# Altium project PS Display.PrjPcb
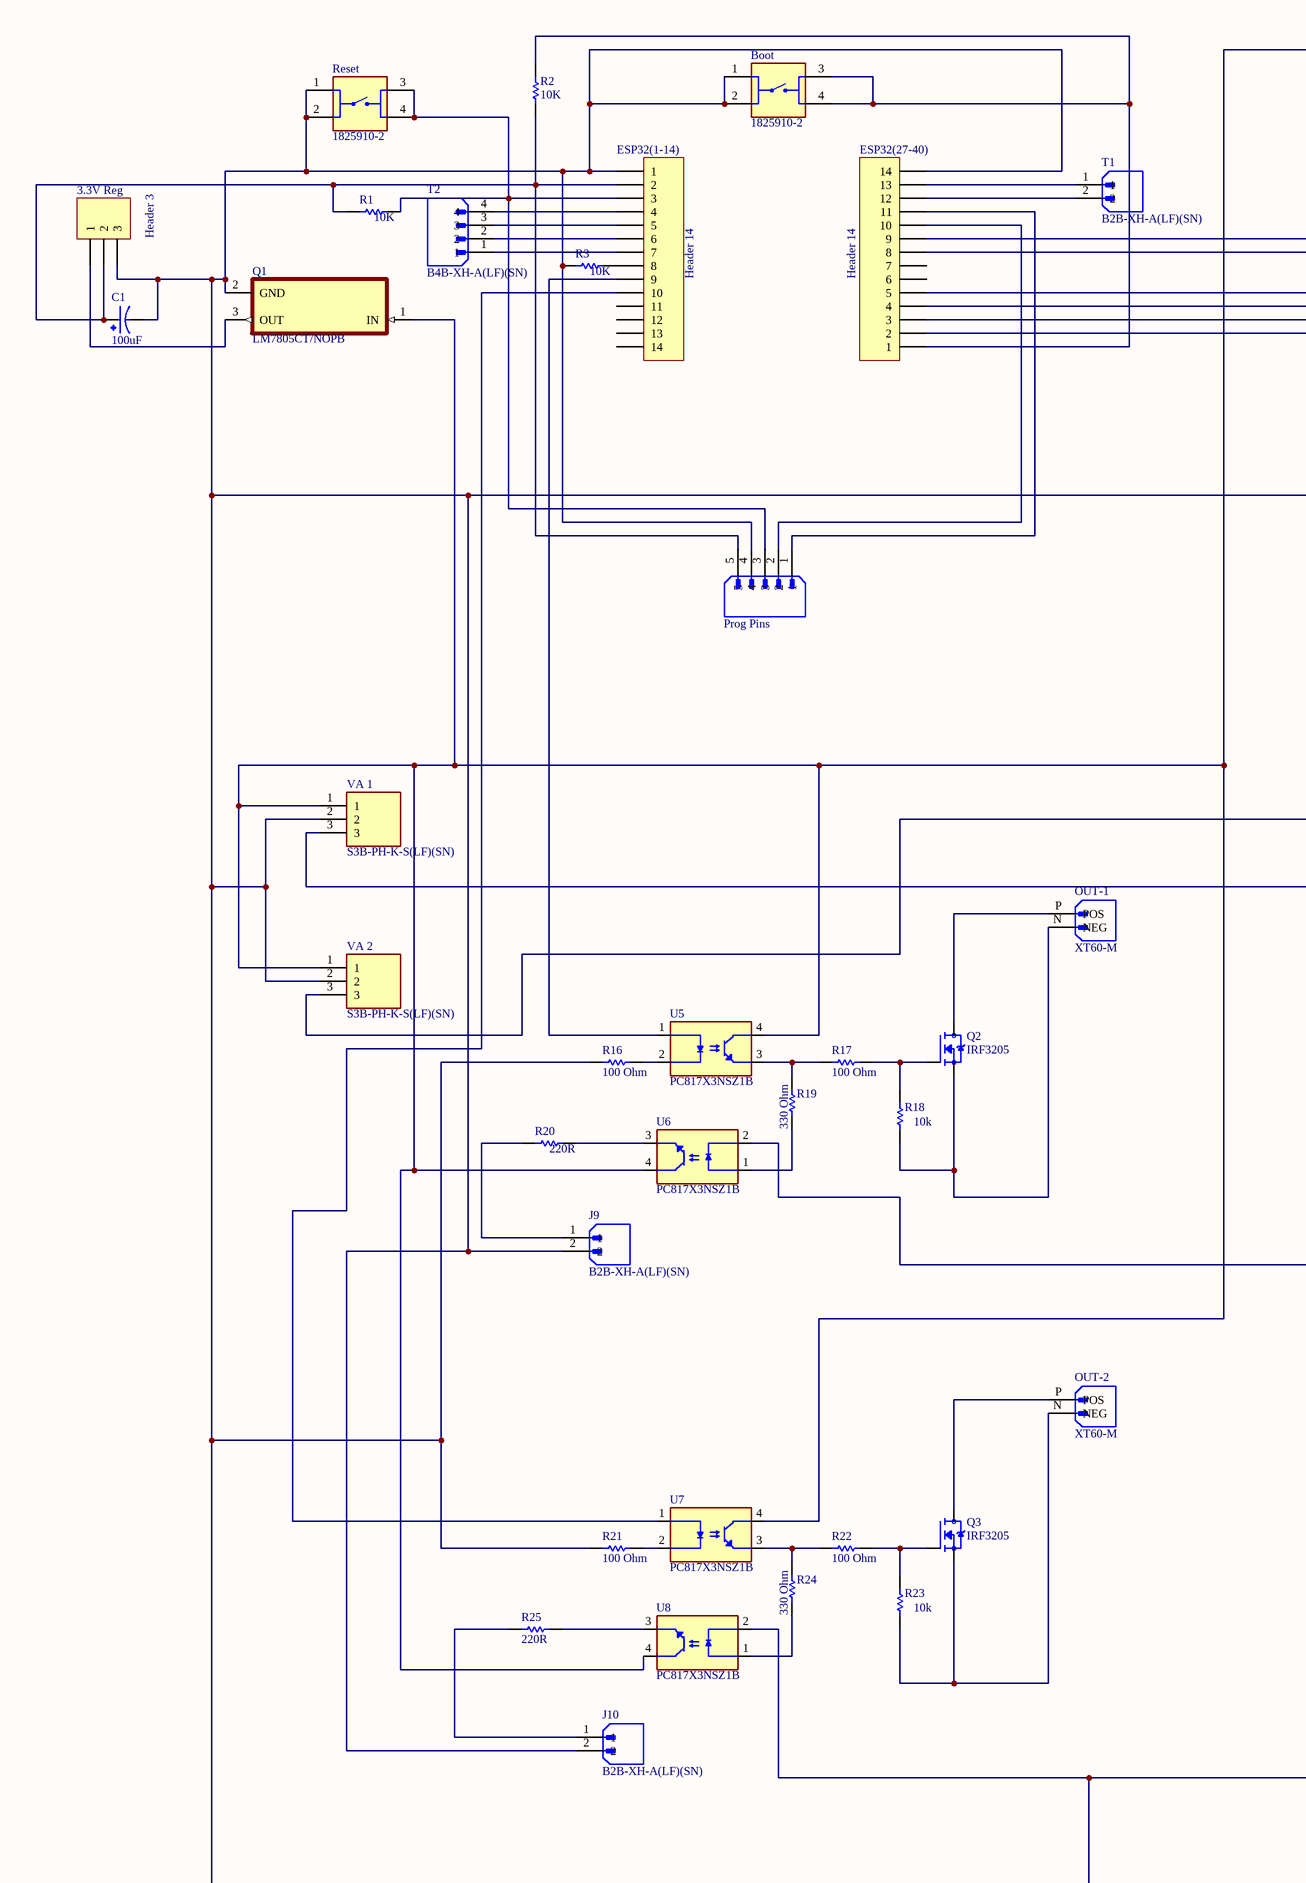
[diagram p0: Sheet1.SchDoc, left]
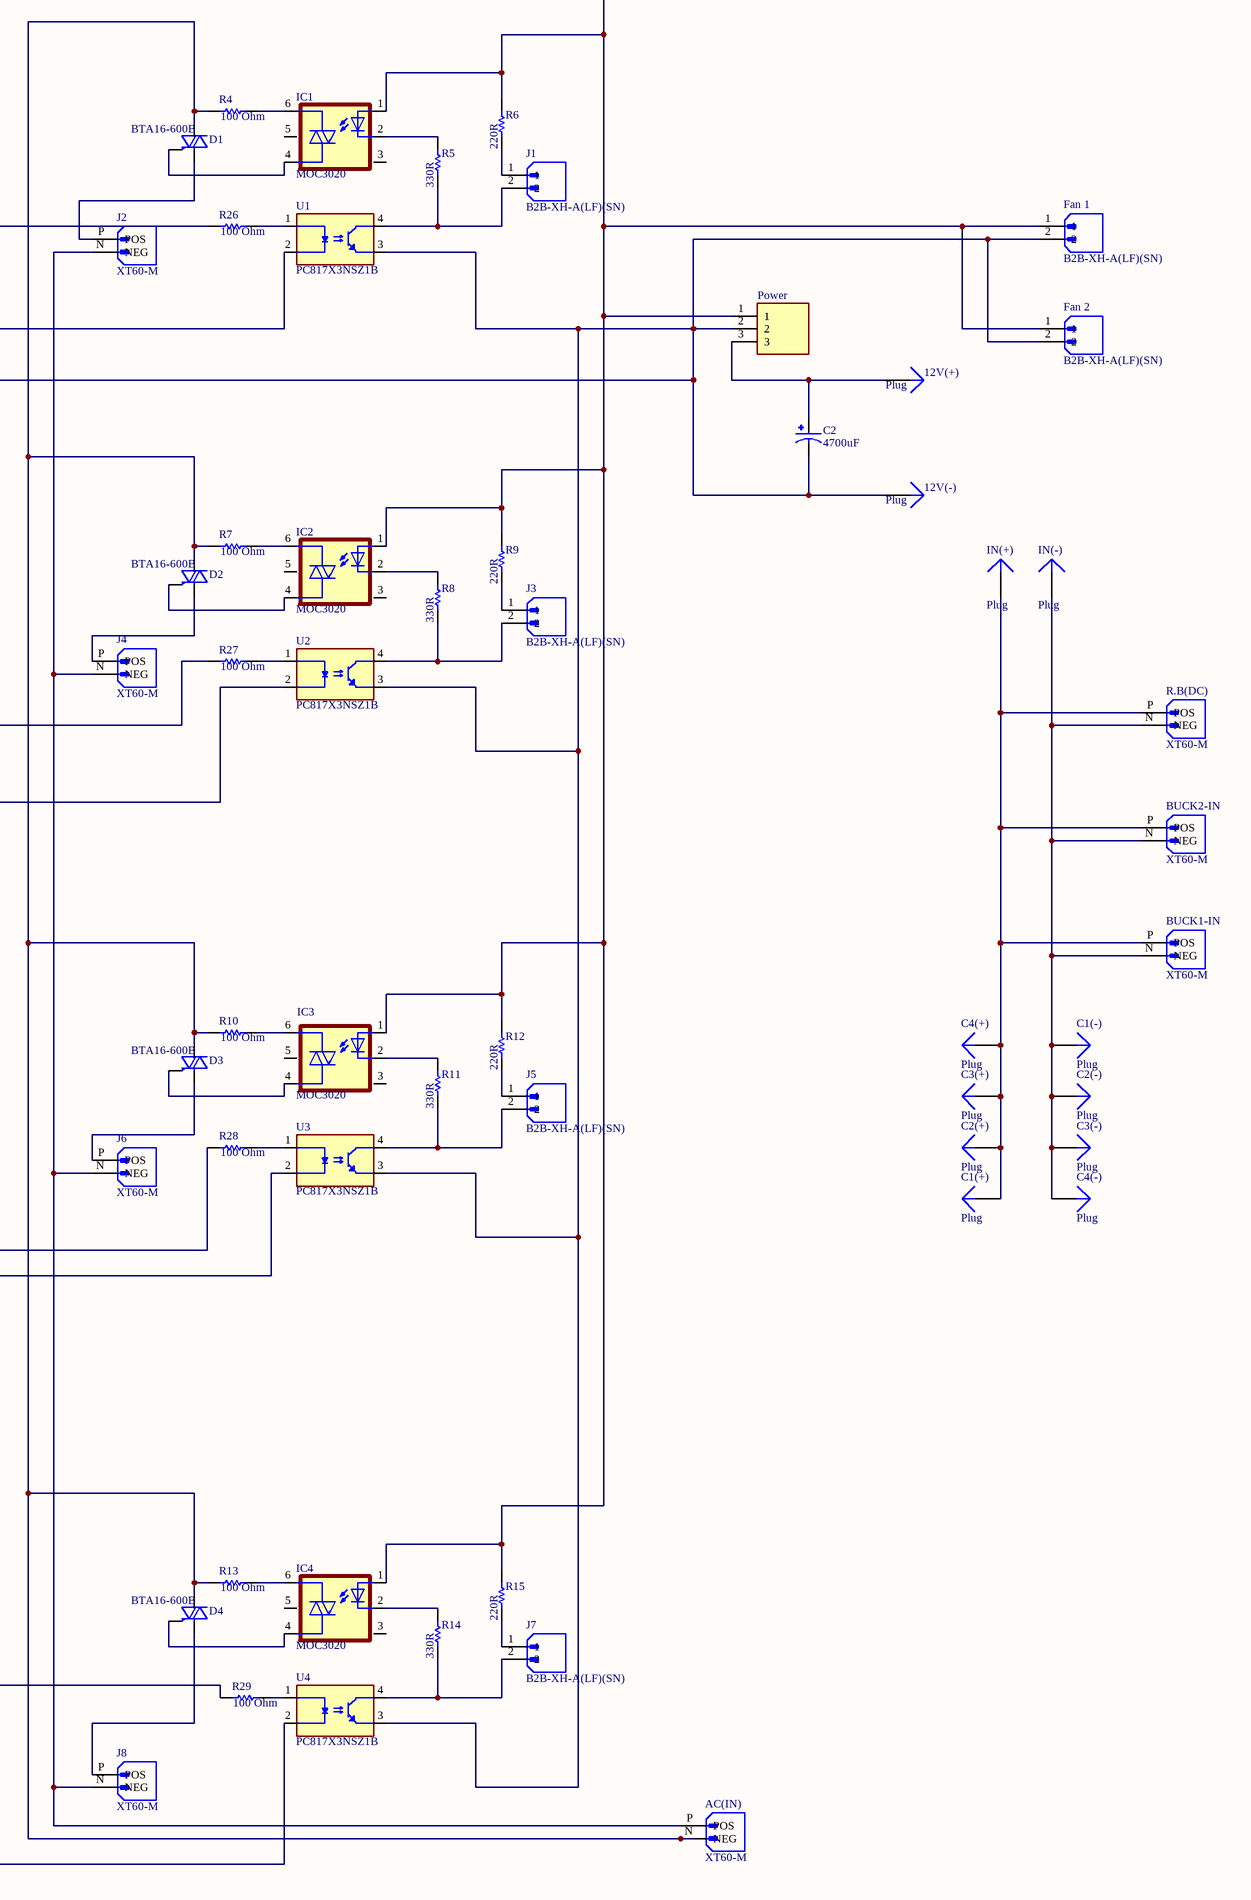
[diagram p1: Sheet1.SchDoc, right]
1 sheet, 91 parts. Net scope: global (net labels, ports and power ports of the same name join across sheets).
Board file: PCB1.PcbDoc

## Sheet Sheet1.SchDoc
size A2

### Parts
3.3V_Reg  Header 3  [HDR1X3]
12V(+)  Plug  [PIN1]
12V(-)  Plug  [PIN1]
AC(IN)  XT60-M  [AMASS_XT60-M]
Boot  1825910-2  [TE_1825910-2]
BUCK1-IN  XT60-M  [AMASS_XT60-M]
BUCK2-IN  XT60-M  [AMASS_XT60-M]
C1  100uF  [CAPPRD250W50D630H1500]
C1(+)  Plug  [PIN1]
C1(-)  Plug  [PIN1]
C2  4700uF  [CAPPRD750W80D1800H3150]
C2(+)  Plug  [PIN1]
C2(-)  Plug  [PIN1]
C3(+)  Plug  [PIN1]
C3(-)  Plug  [PIN1]
C4(+)  Plug  [PIN1]
C4(-)  Plug  [PIN1]
D1  BTA16-600B  [TO255P1040X460X1975-3]
D2  BTA16-600B  [TO255P1040X460X1975-3]
D3  BTA16-600B  [TO255P1040X460X1975-3]
D4  BTA16-600B  [TO255P1040X460X1975-3]
ESP32(1-14)  Header 14  [HDR1X14]
ESP32(27-40)  Header 14  [HDR1X14]
Fan_1  B2B-XH-A(LF)(SN)  [JST_B2B-XH-A(LF)(SN)]
Fan_2  B2B-XH-A(LF)(SN)  [JST_B2B-XH-A(LF)(SN)]
IC1  MOC3020  [DIL06-A]
IC2  MOC3020  [DIL06-A]
IC3  MOC3020  [DIL06-A]
IC4  MOC3020  [DIL06-A]
IN(+)  Plug  [PIN1]
IN(-)  Plug  [PIN1]
J1  B2B-XH-A(LF)(SN)  [JST_B2B-XH-A(LF)(SN)]
J2  XT60-M  [AMASS_XT60-M]
J3  B2B-XH-A(LF)(SN)  [JST_B2B-XH-A(LF)(SN)]
J4  XT60-M  [AMASS_XT60-M]
J5  B2B-XH-A(LF)(SN)  [JST_B2B-XH-A(LF)(SN)]
J6  XT60-M  [AMASS_XT60-M]
J7  B2B-XH-A(LF)(SN)  [JST_B2B-XH-A(LF)(SN)]
J8  XT60-M  [AMASS_XT60-M]
J9  B2B-XH-A(LF)(SN)  [JST_B2B-XH-A(LF)(SN)]
J10  B2B-XH-A(LF)(SN)  [JST_B2B-XH-A(LF)(SN)]
OUT-1  XT60-M  [AMASS_XT60-M]
OUT-2  XT60-M  [AMASS_XT60-M]
Power  (no value)  [JST_S3B-PH-K-S(LF)(SN)]
Prog_Pins  (no value)  [JST_B5B-XH-A(LF)(SN)]
Q1  LM7805CT/NOPB  [TO254P1054X470X1955-3]
Q2  IRF3205  [TO254P1041X444X2933-3]
Q3  IRF3205  [TO254P1041X444X2933-3]
R1  value 10K  [AXIAL-0.3]
R2  value 10K  [AXIAL-0.3]
R3  value 10K  [AXIAL-0.3]
R4  value 100 Ohm  [AXIAL-0.3]
R5  value 330R  [AXIAL-0.3]
R6  value 220R  [AXIAL-0.3]
R7  value 100 Ohm  [AXIAL-0.3]
R8  value 330R  [AXIAL-0.3]
R9  value 220R  [AXIAL-0.3]
R10  value 100 Ohm  [AXIAL-0.3]
R11  value 330R  [AXIAL-0.3]
R12  value 220R  [AXIAL-0.3]
R13  value 100 Ohm  [AXIAL-0.3]
R14  value 330R  [AXIAL-0.3]
R15  value 220R  [AXIAL-0.3]
R16  value 100 Ohm  [AXIAL-0.3]
R17  value 100 Ohm  [AXIAL-0.3]
R18  value 10k  [AXIAL-0.3]
R19  value 330 Ohm  [AXIAL-0.3]
R20  value 220R  [AXIAL-0.3]
R21  value 100 Ohm  [AXIAL-0.3]
R22  value 100 Ohm  [AXIAL-0.3]
R23  value 10k  [AXIAL-0.3]
R24  value 330 Ohm  [AXIAL-0.3]
R25  value 220R  [AXIAL-0.3]
R26  value 100 Ohm  [AXIAL-0.3]
R27  value 100 Ohm  [AXIAL-0.3]
R28  value 100 Ohm  [AXIAL-0.3]
R29  value 100 Ohm  [AXIAL-0.3]
R.B(DC)  XT60-M  [AMASS_XT60-M]
Reset  1825910-2  [TE_1825910-2]
T1  B2B-XH-A(LF)(SN)  [JST_B2B-XH-A(LF)(SN)]
T2  B4B-XH-A(LF)(SN)  [JST_B4B-XH-A(LF)(SN)]
U1  PC817X3NSZ1B  [DIP762W50P254L495H455Q4]
U2  PC817X3NSZ1B  [DIP762W50P254L495H455Q4]
U3  PC817X3NSZ1B  [DIP762W50P254L495H455Q4]
U4  PC817X3NSZ1B  [DIP762W50P254L495H455Q4]
U5  PC817X3NSZ1B  [DIP762W50P254L495H455Q4]
U6  PC817X3NSZ1B  [DIP762W50P254L495H455Q4]
U7  PC817X3NSZ1B  [DIP762W50P254L495H455Q4]
U8  PC817X3NSZ1B  [DIP762W50P254L495H455Q4]
VA_1  S3B-PH-K-S(LF)(SN)  [JST_S3B-PH-K-S(LF)(SN)]
VA_2  S3B-PH-K-S(LF)(SN)  [JST_S3B-PH-K-S(LF)(SN)]

### Nets
Net3.3V_Reg_1: 3.3V_Reg.1 Q1.3(OUT)
Net3.3V_Reg_2: 3.3V_Reg.2 C1.P ESP32(1-14).2 Prog_Pins.5 R1.1 R2.1
Net3.3V_Reg_3: 3.3V_Reg.3 12V(-).1 Boot.1 Boot.2 C1.N C2.N ESP32(1-14).1 ESP32(27-40).14 Fan_1.2 Fan_2.2 J9.2 J10.2 Power.2 Prog_Pins.4 Q1.2(GND) R3.1 R16.2 R21.2 Reset.1 Reset.2 U1.3(EMITTER) U2.3(EMITTER) U3.3(EMITTER) U4.3(EMITTER) U6.2(CATHODE) U8.2(CATHODE) VA_1.2 VA_2.2
Net12V(+)_1: 12V(+).1 C2.P Power.3
NetAC(IN)_N: AC(IN).N(NEG) D1.2(A2) D2.2(A2) D3.2(A2) D4.2(A2) R4.1 R7.1 R10.1 R13.1
NetAC(IN)_P: AC(IN).P(POS) J2.N(NEG) J4.N(NEG) J6.N(NEG) J8.N(NEG)
NetBoot_3: Boot.3 Boot.4 ESP32(27-40).1 R2.2
NetBUCK1-IN_N: BUCK1-IN.N(NEG) BUCK2-IN.N(NEG) C1(-).1 C2(-).1 C3(-).1 C4(-).1 IN(-).1 R.B(DC).N(NEG)
NetBUCK1-IN_P: BUCK1-IN.P(POS) BUCK2-IN.P(POS) C1(+).1 C2(+).1 C3(+).1 C4(+).1 IN(+).1 R.B(DC).P(POS)
NetD1_1: D1.1(A1) J2.P(POS)
NetD1_3: D1.3(G) IC1.4(A1)
NetD2_1: D2.1(A1) J4.P(POS)
NetD2_3: D2.3(G) IC2.4(A1)
NetD3_1: D3.1(A1) J6.P(POS)
NetD3_3: D3.3(G) IC3.4(A1)
NetD4_1: D4.1(A1) J8.P(POS)
NetD4_3: D4.3(G) IC4.4(A1)
NetESP32(1-14)_3: ESP32(1-14).3 Prog_Pins.3 R1.2 Reset.3 Reset.4
NetESP32(1-14)_4: ESP32(1-14).4 T2.4
NetESP32(1-14)_5: ESP32(1-14).5 T2.3
NetESP32(1-14)_6: ESP32(1-14).6 T2.2
NetESP32(1-14)_7: ESP32(1-14).7 T2.1
NetESP32(1-14)_8: ESP32(1-14).8 R3.2
NetESP32(1-14)_9: ESP32(1-14).9 U5.1(ANODE)
NetESP32(1-14)_10: ESP32(1-14).10 U7.1(ANODE)
NetESP32(27-40)_2: ESP32(27-40).2 R26.1
NetESP32(27-40)_3: ESP32(27-40).3 R27.1
NetESP32(27-40)_4: ESP32(27-40).4 R28.1
NetESP32(27-40)_5: ESP32(27-40).5 R29.1
NetESP32(27-40)_8: ESP32(27-40).8 VA_1.3
NetESP32(27-40)_9: ESP32(27-40).9 VA_2.3
NetESP32(27-40)_10: ESP32(27-40).10 Prog_Pins.2
NetESP32(27-40)_11: ESP32(27-40).11 Prog_Pins.1
NetESP32(27-40)_12: ESP32(27-40).12 T1.2
NetESP32(27-40)_13: ESP32(27-40).13 T1.1
NetFan_1_1: Fan_1.1 Fan_2.1 IC1.1(A) IC2.1(A) IC3.1(A) IC4.1(A) Power.1 Q1.1(IN) R6.2 R9.2 R12.2 R15.2 U5.4(COLLECTOR) U6.4(COLLECTOR) U7.4(COLLECTOR) U8.4(COLLECTOR) VA_1.1 VA_2.1
NetIC1_2: IC1.2(C) R5.2
NetIC1_6: IC1.6(A2) R4.2
NetIC2_2: IC2.2(C) R8.2
NetIC2_6: IC2.6(A2) R7.2
NetIC3_2: IC3.2(C) R11.2
NetIC3_6: IC3.6(A2) R10.2
NetIC4_2: IC4.2(C) R14.2
NetIC4_6: IC4.6(A2) R13.2
NetJ1_1: J1.1 R6.1
NetJ1_2: J1.2 R5.1 U1.4(COLLECTOR)
NetJ3_1: J3.1 R9.1
NetJ3_2: J3.2 R8.1 U2.4(COLLECTOR)
NetJ5_1: J5.1 R12.1
NetJ5_2: J5.2 R11.1 U3.4(COLLECTOR)
NetJ7_1: J7.1 R15.1
NetJ7_2: J7.2 R14.1 U4.4(COLLECTOR)
NetJ9_1: J9.1 R20.2
NetJ10_1: J10.1 R25.2
NetOUT-1_N: OUT-1.N(NEG) Q2.3(S) R18.1
NetOUT-1_P: OUT-1.P(POS) Q2.2(D)
NetOUT-2_N: OUT-2.N(NEG) Q3.3(S) R23.1
NetOUT-2_P: OUT-2.P(POS) Q3.2(D)
NetQ2_1: Q2.1(G) R17.1 R18.2
NetQ3_1: Q3.1(G) R22.1 R23.2
NetR16_1: R16.1 U5.2(CATHODE)
NetR17_2: R17.2 R19.2 U5.3(EMITTER)
NetR19_1: R19.1 U6.1(ANODE)
NetR20_1: R20.1 U6.3(EMITTER)
NetR21_1: R21.1 U7.2(CATHODE)
NetR22_2: R22.2 R24.2 U7.3(EMITTER)
NetR24_1: R24.1 U8.1(ANODE)
NetR25_1: R25.1 U8.3(EMITTER)
NetR26_2: R26.2 U1.1(ANODE)
NetR27_2: R27.2 U2.1(ANODE)
NetR28_2: R28.2 U3.1(ANODE)
NetR29_2: R29.2 U4.1(ANODE)
NetU1_2: U1.2(CATHODE) U2.2(CATHODE) U3.2(CATHODE) U4.2(CATHODE)

Not connected (* = marked no-connect by the designer): ESP32(1-14) 11 12 13 14; ESP32(27-40) 6 7; IC1 3(P$1) 5(P$2); IC2 3(P$1) 5(P$2); IC3 3(P$1) 5(P$2); IC4 3(P$1) 5(P$2)

### Library data of the parts
3.3V_Reg = Header 3: Header, 3-Pin; LatestRevisionDate: 17-Jul-2002; LatestRevisionNote: Re-released for DXP Platform.; Publisher: Altium Limited
AC(IN) BUCK1-IN BUCK2-IN J2 J4 J6 J8 OUT-1 OUT-2 R.B(DC) = XT60-M: Plug; DC supply; XT60; male; PIN: 2; for cable; soldered; 30A; 500V; MF: AMASS; Price: None; Availability: Not in stock; Package: Package; MP: XT60-M; Value: *; SnapEDA_Link: https://www.snapeda.com/parts/XT60-M/AMASS/view-part/?ref=snap; Check_prices: https://www.snapeda.com/parts/XT60-M/AMASS/view-part/?ref=eda
Boot Reset = 1825910-2: 50 mA SPST Round Actuator 160 Gram Force Tactile Pushbutton Switch; MF: TE Connectivity; Check_prices: https://www.snapeda.com/parts/1825910-2/TE+Connectivity+ALCOSWITCH+Switches/view-part/?ref=eda; Value: *; Availability: In Stock; MP: 1825910-2; Price: None; Package: None; SnapEDA_Link: https://www.snapeda.com/parts/1825910-2/TE+Connectivity+ALCOSWITCH+Switches/view-part/?ref=snap; Purchase-URL: https://pricing.snapeda.com/search/part/1825910-2/?ref=eda; EU_RoHS_Compliance: Compliant
C1 = EEUEB1E101: CAP ALUM 100UF 20% 25V RADIAL; MF: Panasonic; Check_prices: https://www.snapeda.com/parts/EEUEB1E101/Panasonic/view-part/?ref=eda; Value: *; Availability: In Stock; MP: EEUEB1E101; Price: None; Package: RADIAL-2 Panasonic; SnapEDA_Link: https://www.snapeda.com/parts/EEUEB1E101/Panasonic/view-part/?ref=snap; Purchase-URL: https://pricing.snapeda.com/search/part/EEUEB1E101/?ref=eda
C2 = EEUTP1E472: CAP ALUM 4700UF 20% 25V RADIAL; MF: Panasonic; MP: EEU-TP1E472; Value: *; Price: None; Package: RADIAL-2 Panasonic; Availability: In Stock; Purchase-URL: https://pricing.snapeda.com/search/part/EEU-TP1E472/?ref=eda; Check_prices: https://www.snapeda.com/parts/EEU-TP1E472/Panasonic/view-part/2307869/?ref=eda; SnapEDA_Link: https://www.snapeda.com/parts/EEU-TP1E472/Panasonic/view-part/2307869/?ref=snap
D1-D4 = BTA16-600B: TRIAC Standard 600V 16A Through Hole IITO-220E; Package: None; Price: None; Availability: Unavailable; MP: BTA16-600B; Value: *
ESP32(1-14) ESP32(27-40) = Header 14: Header, 14-Pin; LatestRevisionDate: 17-Jul-2002; LatestRevisionNote: Re-released for DXP Platform.; Publisher: Altium Limited
Fan_1 Fan_2 J1 J3 J5 J7 J9 J10 T1 = B2B-XH-A(LF)(SN): Connector Header Through Hole 2 position 0.098 (2.50mm); MF: JST Sales America Inc.; SnapEDA_Link: https://www.snapeda.com/parts/B2B-XH-A(LF)(SN)/JST+Sales+America+Inc./view-part/?ref=snap; Price: None; Check_prices: https://www.snapeda.com/parts/B2B-XH-A(LF)(SN)/JST+Sales+America+Inc./view-part/?ref=eda; Purchase-URL: https://pricing.snapeda.com/search/part/B2B-XH-A(LF)(SN)/?ref=eda; Value: *; MP: B2B-XH-A(LF)(SN); Package: None; Availability: In Stock
IC1-IC4 = MOC3020: Optoisolator Triac Output 5300Vrms 1 Channel 6-DIP; MF: ON Semiconductor; SnapEDA_Link: https://www.snapeda.com/parts/MOC3020/ON%20Semiconductor/view-part/2780094/?ref=snap; MP: MOC3020; Availability: Unavailable; Price: None; Value: *; Package: DIP-6 ON Semiconductor
Power VA_1 VA_2 = S3B-PH-K-S(LF)(SN): Connector Header Through Hole, Right Angle 3 position 0.079" (2.00mm); Price: None; MP: S3B-PH-K-S(LF)(SN); Availability: Unavailable; Value: *; Package: None
Prog_Pins = B5B-XH-A(LF)(SN): Connector Header Through Hole 5 position 0.098 (2.50mm); MF: JST Sales America Inc.; MP: B5B-XH-A(LF)(SN); Value: *; Availability: In Stock; Package: None; Purchase-URL: https://pricing.snapeda.com/search/part/B5B-XH-A(LF)(SN)/?ref=eda; Price: None; SnapEDA_Link: https://www.snapeda.com/parts/B5B-XH-A(LF)(SN)/JST+Sales+America+Inc./view-part/?ref=snap; Check_prices: https://www.snapeda.com/parts/B5B-XH-A(LF)(SN)/JST+Sales+America+Inc./view-part/?ref=eda
Q2 Q3 = IRF3205: N-Channel 55V 110A (Tc) 200W (Tc) Through Hole TO-220AB; MF: Infineon Technologies; Price: None; Value: *; Purchase-URL: https://pricing.snapeda.com/search/part/IRF3205/?ref=eda; Package: TO-220 Infineon; Availability: In Stock; MP: IRF3205; SnapEDA_Link: https://www.snapeda.com/parts/IRF3205/Infineon+Technologies/view-part/?ref=snap; Check_prices: https://www.snapeda.com/parts/IRF3205/Infineon+Technologies/view-part/?ref=eda
R1-R29 = Res1: Resistor; Published: 8-Jun-2000; LatestRevisionDate: 17-Jul-2002; LatestRevisionNote: Re-released for DXP Platform.; PackageReference: AXIAL-0.3; Publisher: Altium Limited; PackageDescription: Axial Device, Thru-Hole; 2 Leads; 0.3 in Pin Spacing
T2 = B4B-XH-A(LF)(SN): Connector Header Through Hole 4 position 0.098 (2.50mm); MF: JST Sales; SnapEDA_Link: https://www.snapeda.com/parts/B4B-XH-A(LF)(SN)/JST+Sales+America+Inc./view-part/?ref=snap; Package: None; MP: B4B-XH-A(LF)(SN); Check_prices: https://www.snapeda.com/parts/B4B-XH-A(LF)(SN)/JST+Sales+America+Inc./view-part/?ref=eda; Purchase-URL: https://pricing.snapeda.com/search/part/B4B-XH-A(LF)(SN)/?ref=eda; Price: None; Value: *; Availability: In Stock
U1-U8 = PC817X3NSZ1B: Optoisolator Transistor Output - 1 Channel 4-DIP; MF: Sharp Microelectronics; SnapEDA_Link: https://www.snapeda.com/parts/PC817X3NSZ1B/Sharp+Microelectronics/view-part/?ref=snap; Price: None; Purchase-URL: https://pricing.snapeda.com/search/part/PC817X3NSZ1B/?ref=eda; Check_prices: https://www.snapeda.com/parts/PC817X3NSZ1B/Sharp+Microelectronics/view-part/?ref=eda; MP: PC817X3NSZ1B; Value: *; Availability: In Stock; Package: DIP-4 Sharp Microelectronics
12V(+) 12V(-) C1(+) C1(-) C2(+) C2(-) C3(+) C3(-) C4(+) C4(-) IN(+) IN(-) = Plug: LatestRevisionDate: 17-Jul-2002; LatestRevisionNote: Re-released for DXP Platform.; Publisher: Altium Limited
Q1 = LM7805CT/NOPB: Price: None; MP: LM7805CT/NOPB; Availability: Unavailable; Value: *; Package: None